# EasyEDA Pro project EasyEda_Pro_Project_file.epro

# Schematic NFC Card
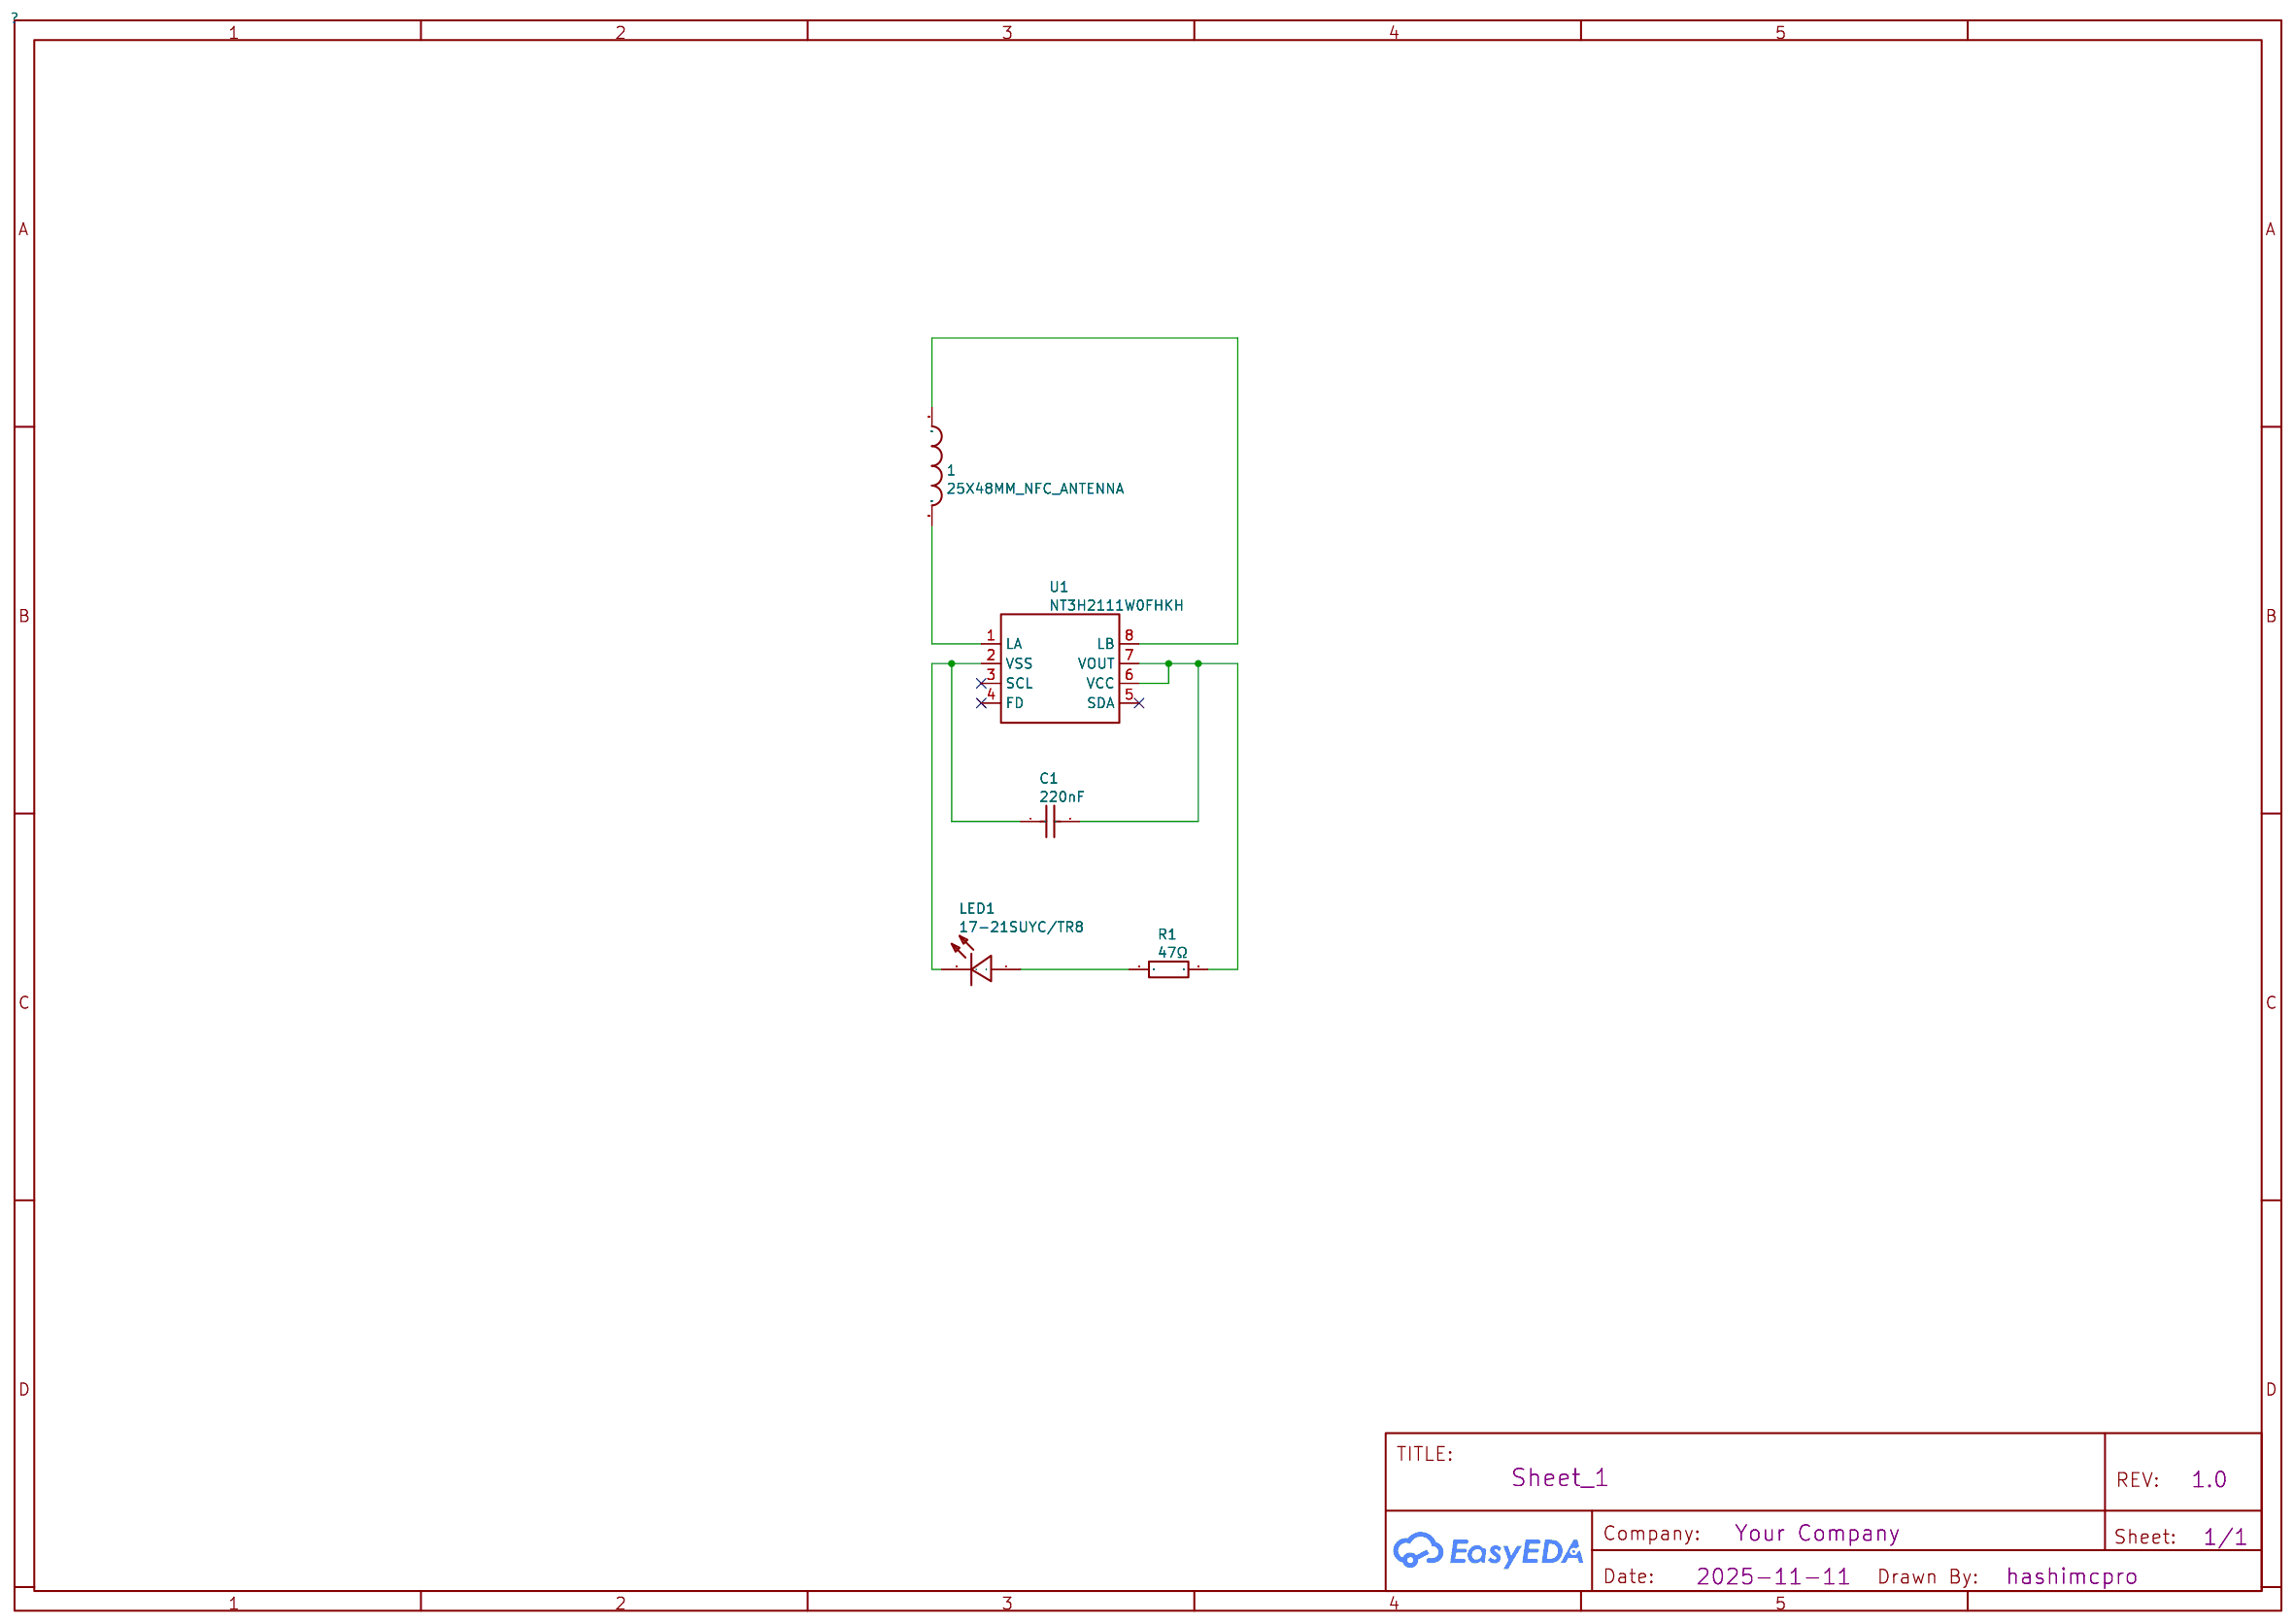
[diagram p0: schematic sheet]

## Parts
1  25X48MM_NFC_ANTENNA  [25X48MM_NFC_ANTENNA]
C1  220nF  [C0603]
LED1  17-21SUYC/TR8  [LED0805-R-RD]
R1  47Ω  [R0603]
U1  NT3H2111W0FHKH  [XQFN-8_L1.6-W1.6-P0.50-BL_NT3H2111W0FHKH]

## Library data of the parts
1 = 25X48MM_NFC_ANTENNA: Contributor: dnonoo; spicePre: ?
C1 = 220nF: Supplier: LCSC; Manufacturer Part: CL10B224KA8NNNC; Manufacturer: SAMSUNG(三星); Supplier Part: C21120; JLCPCB Part Class: Basic Part; nameAlias: Value; spicePre: C; spiceSymbolName: CL10B224KA8NNNC
LED1 = 17-21SUYC/TR8: Supplier: LCSC; Manufacturer: KENTO; Manufacturer Part: KT-0805黄灯; Supplier Part: C2296; JLCPCB Part Class: Basic Part; spicePre: L
R1 = 47Ω: Supplier: LCSC; Manufacturer: UNI-ROYAL(厚声); Manufacturer Part: 0603WAF470JT5E; Supplier Part: C23182; JLCPCB Part Class: Basic Part; nameAlias: Value; spicePre: R; spiceSymbolName: 0603WAF470JT5E
U1 = NT3H2111W0FHKH: Supplier: LCSC; Supplier Part: C710403; Manufacturer: NXP(恩智浦); JLCPCB Part Class: Extended Part; Contributor: LCSC; spicePre: U

## Nets
LED1_1: LED1.1(+) R1.1
U1_1: 1.P$2 U1.1(LA)
U1_2: C1.1 LED1.2(-) U1.2(VSS)
U1_7: C1.2 R1.2 U1.6(VCC) U1.7(VOUT)
U1_8: 1.P$1 U1.8(LB)

Not connected (* = marked no-connect by the designer): U1 3(SCL)* 4(FD)* 5(SDA)*

# Board PCB_PCB_NFC-Card_2025-11-12
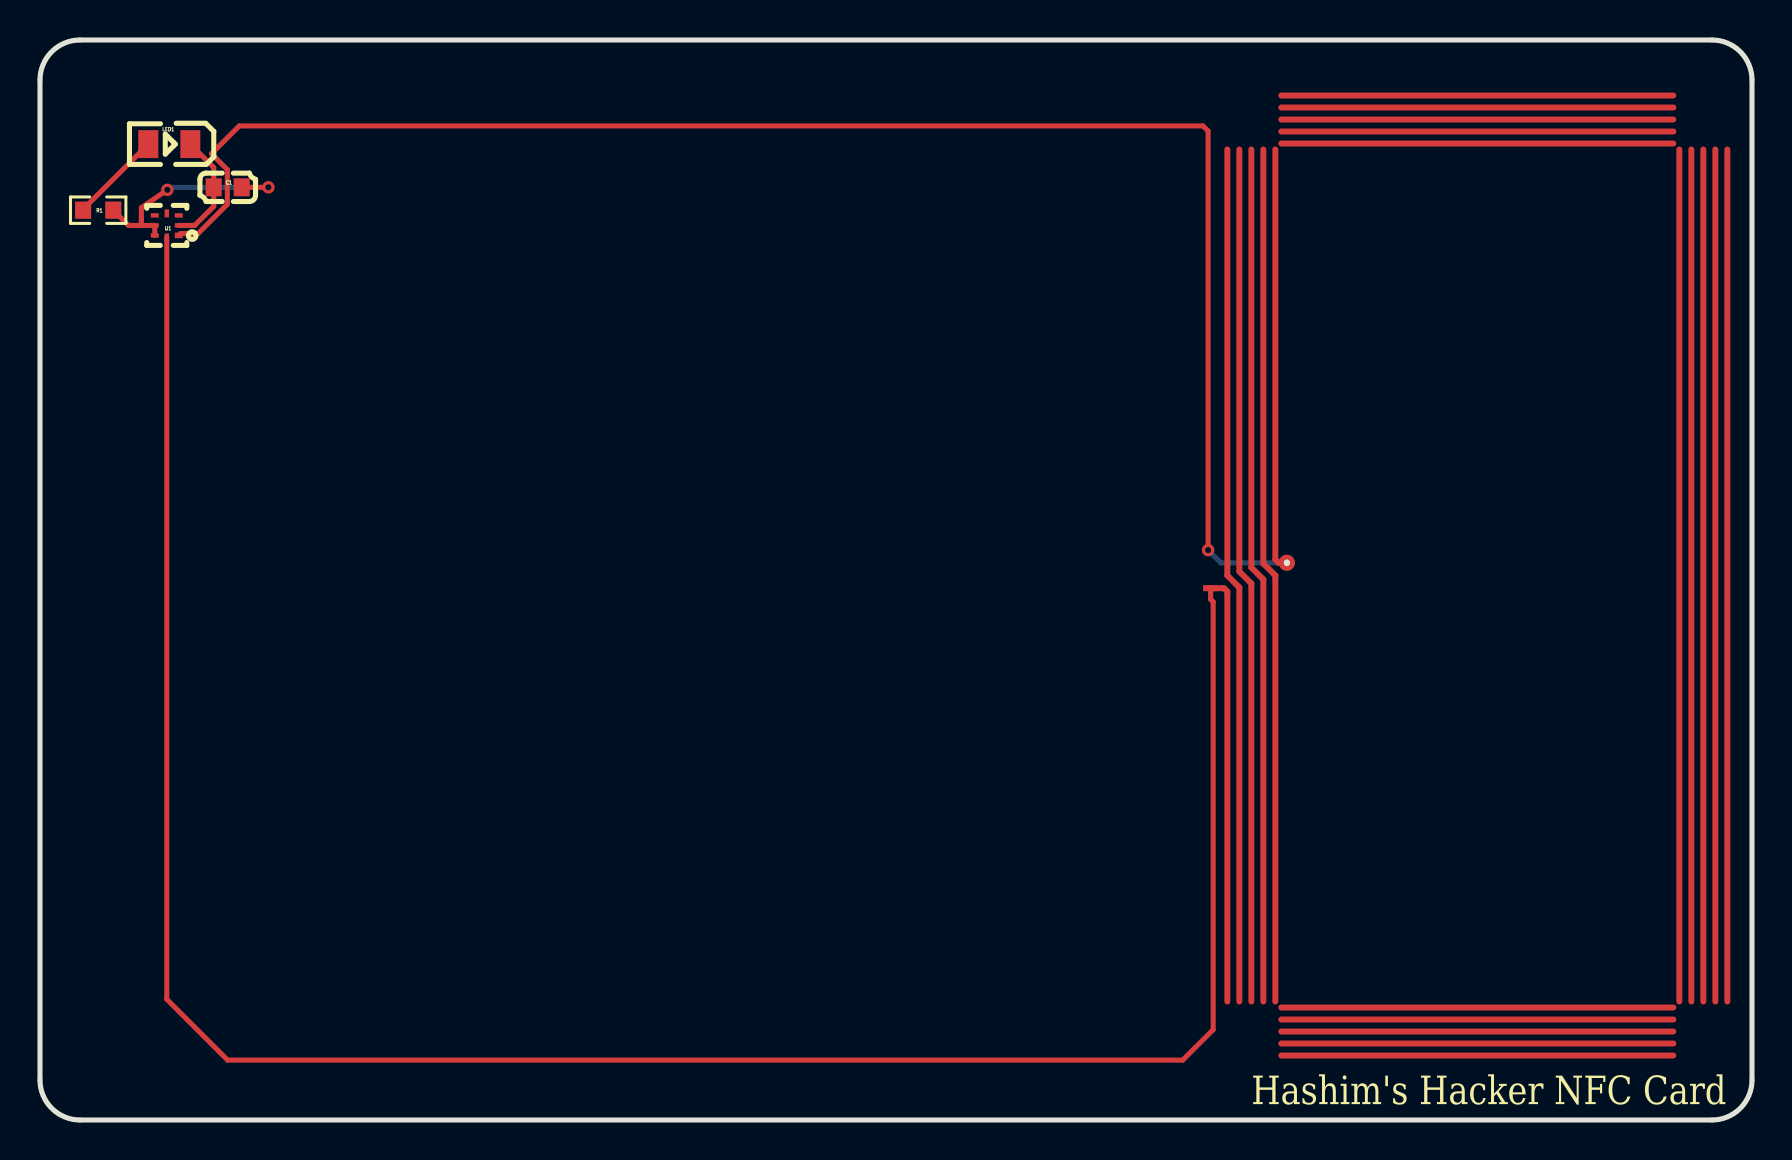
[diagram p1: board, top side]
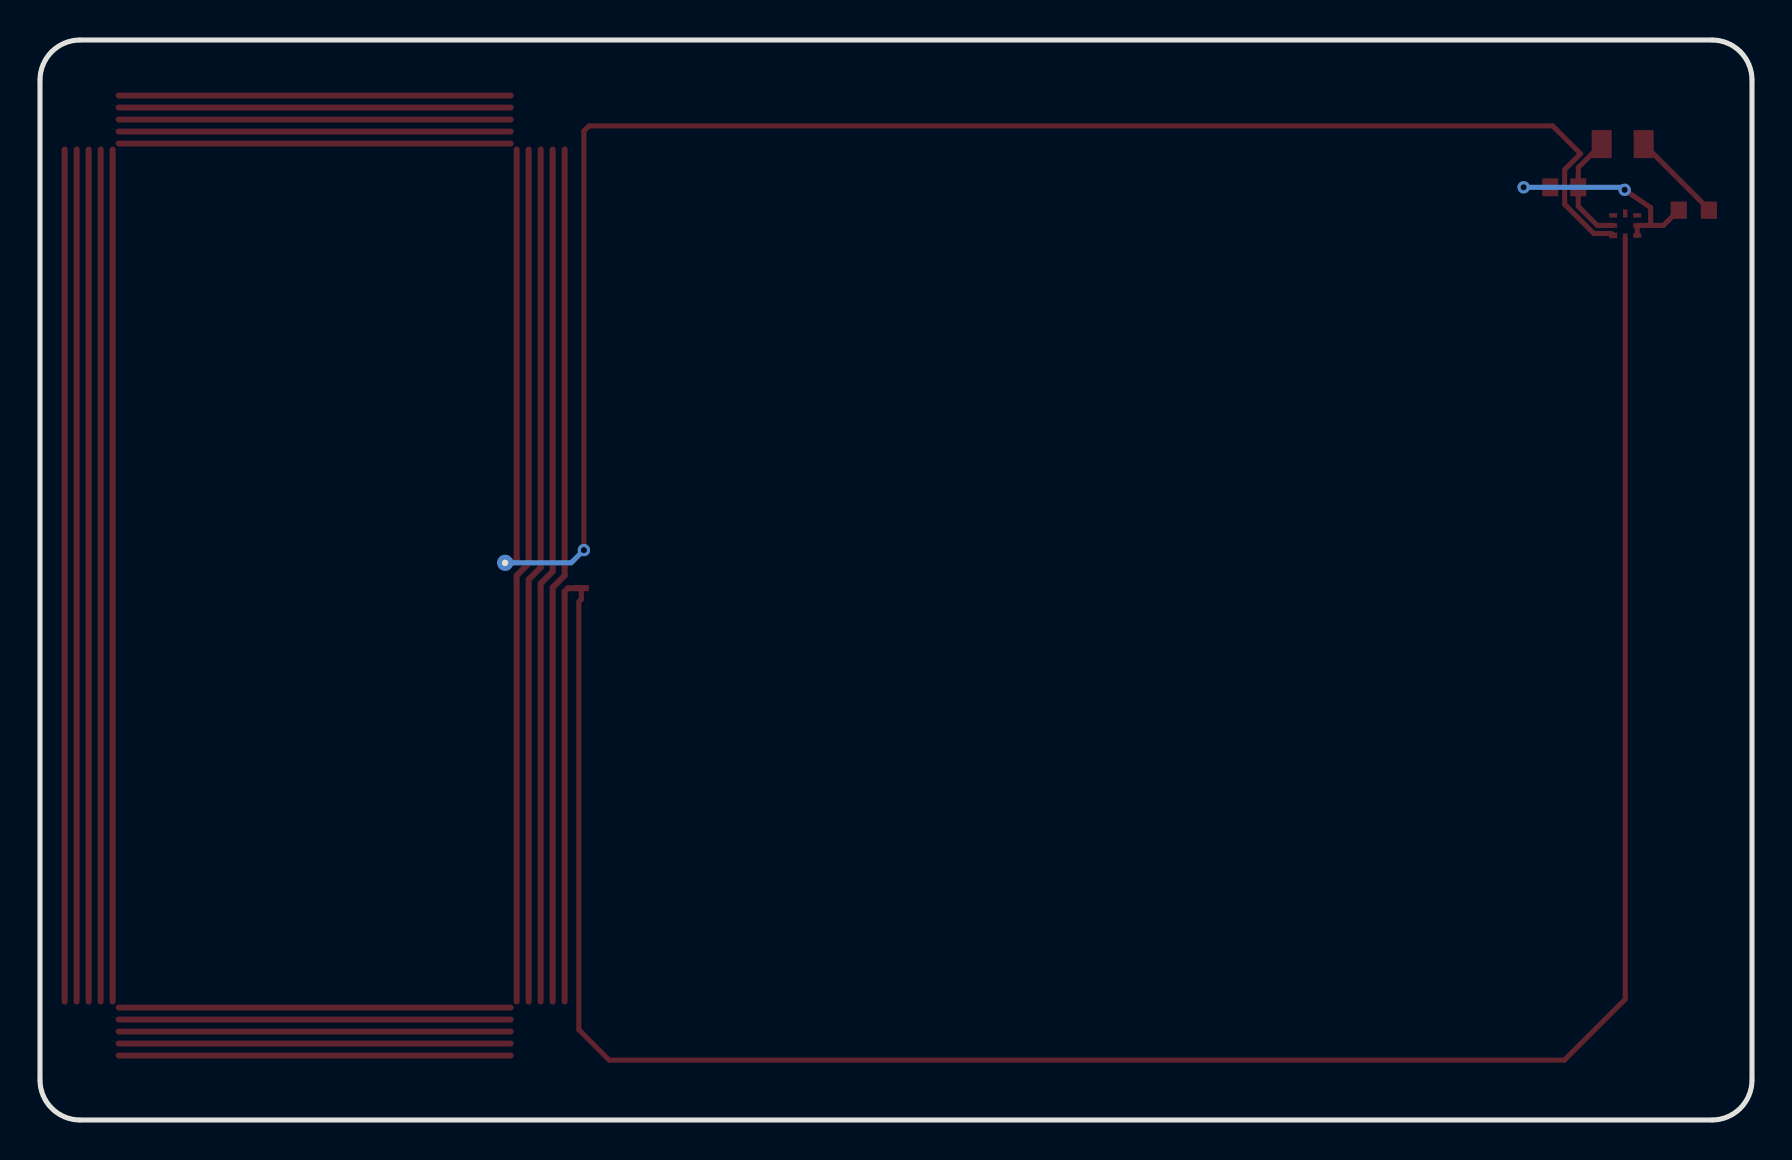
[diagram p2: board, bottom side, seen from below]

Outline 85.6 x 54 mm; copper layers: Top Layer, Bottom Layer. Coordinates in mm from the lower left corner of the outline.
Outline path: 0,52 arc(0.59,53.41) 2,54 83.6,54 arc(85.01,53.41) 85.6,52 85.6,2 arc(85.01,0.59) 83.6,0 2,0 arc(0.59,0.59) 0,2 0,52
Stack: Top Layer 0.035mm / Dielectric1 1.51mm FR4 er 4.5 / Bottom Layer 0.035mm

## Design rules (mm)
spacing Default (default): track to track 0.152, other pairs 0 to 0.152
track width Default (default): min 0.254, default 0.254, max 25.4
differential pair differentialPair (default): width min 0.127, default 0.254, max 2.54; gap min 0.152, default 0.152
via Default (default): diameter min 0.61, default 0.61, max 100.025; hole min 0.305, default 0.305, max 59.995

## Placement (name value [footprint] x y rotation side)
1  -  [25X48MM_NFC_ANTENNA]  71.87 27.22 90 top
C1  220nF  [C0603]  9.39 46.63 0 top
LED1  17-21SUYC/TR8  [LED0805-R-RD]  6.47 48.79 180 top
R1  47Ω  [R0603]  2.91 45.49 0 top
U1  NT3H2111W0FHKH  [XQFN-8_L1.6-W1.6-P0.50-BL_NT3H2111W0FHKH]  6.34 44.73 180 top

## Footprints (pads in the part's own frame, mm; a bottom-side part is the same pattern mirrored in y, then rotated)
25X48MM_NFC_ANTENNA
  rect 0.3x0.75 smd: P$1(-0.635,13.335)
  round 0.808 hole 0.32x0.305: P$2(0.635,9.525)
C0603
  rect 0.8x0.9 smd: 1(-0.7,0) 2(0.7,0)
LED0805-R-RD
  rect 1x1.399 smd: 1(1.05,0) 2(-1.05,0)
R0603
  rect 0.806x0.864 smd: 1(-0.753,0) 2(0.753,0)
XQFN-8_L1.6-W1.6-P0.50-BL_NT3H2111W0FHKH
  rect 0.4x0.28 smd: 1(-0.6,0.5)
  rect 0.4x0.22 smd: 2(-0.6,0) 3(-0.6,-0.5) 5(0.6,-0.5) 6(0.6,0) 7(0.6,0.5)
  rect 0.22x0.4 smd: 4(0,-0.6) 8(0,0.6)

## Nets
As in the schematic.

Pads without a net: U1 3 4 5

## Via types
v1: diameter 0.62, hole 0.31, Top Layer to Bottom Layer, 3 vias

## Routing (per net, layer and track width the routed paths; a pad name or vN(x,y) marks a point on that pad's centre or on a via; arc(x,y) is an arc through that point)
LED1_1: length 4.7
  Top Layer w0.254: R1.1 2.16,45.53 LED1.1
U1_1: length 81.6
  Top Layer w0.254: U1.1 7.03,44.32 7.9,44.32 9.37,45.79 9.37,47.52 8.57,48.31 9.96,49.7 58.15,49.7 58.41,49.45 v1(58.41,28.5)
  Bottom Layer w0.254: v1(58.41,28.5) 59.04,27.86 1.P$2
U1_2: length 5.7
  Top Layer w0.254: U1.2 7.74,44.73 8.69,45.68 C1.1 8.69,47.62 LED1.2
U1_7: length 11.8
  Top Layer w0.254: R1.2 4.43,44.73 5.07,44.73 ; v1(6.37,46.51) 5.07,45.62 5.07,44.73 ; U1.7 U1.6 5.07,44.73 ; v1(11.42,46.63) C1.2
  Bottom Layer w0.254: v1(11.42,46.63) 6.49,46.63 v1(6.37,46.51)
U1_8: length 114.4
  Top Layer w0.254: U1.8 6.34,6.04 9.38,2.99 57.13,2.99 58.66,4.52 58.66,25.91 58.53,26.03 1.P$1

## Text on the board
Top Silkscreen Layer: Hashim's Hacker NFC Card
